# Altium schematic sheet Top.SchDoc: Top
size A; Author: CLS Team; Revision: 1.0; SheetNumber: 1; SheetTotal: 10
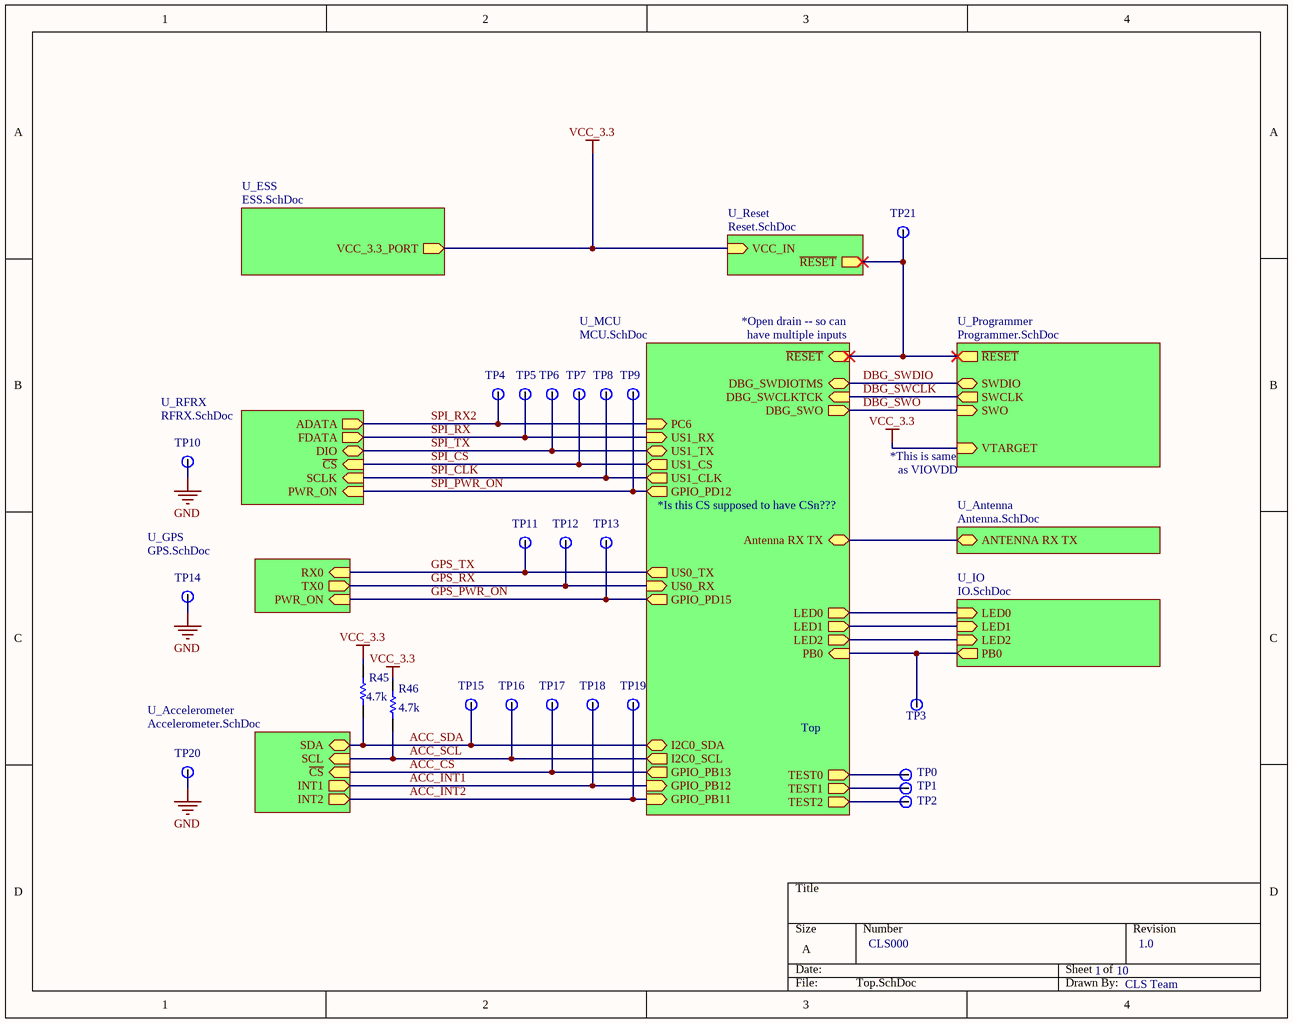
[diagram p0: Top.SchDoc]

## Parts
R45  value 4.7k  [0805_CHIP_FP]  (hidden comment: Resistor_0805)
R46  value 4.7k  [0805_CHIP_FP]  (hidden comment: Resistor_0805)
TP0  Testpoint  [HDR1X1]  (value not drawn)
TP1  Testpoint  [HDR1X1]  (value not drawn)
TP2  Testpoint  [HDR1X1]  (value not drawn)
TP3  Testpoint  [HDR1X1]  (value not drawn)
TP4  Testpoint  [HDR1X1]  (value not drawn)
TP5  Testpoint  [HDR1X1]  (value not drawn)
TP6  Testpoint  [HDR1X1]  (value not drawn)
TP7  Testpoint  [HDR1X1]  (value not drawn)
TP8  Testpoint  [HDR1X1]  (value not drawn)
TP9  Testpoint  [HDR1X1]  (value not drawn)
TP10  Testpoint  [HDR1X1]  (value not drawn)
TP11  Testpoint  [HDR1X1]  (value not drawn)
TP12  Testpoint  [HDR1X1]  (value not drawn)
TP13  Testpoint  [HDR1X1]  (value not drawn)
TP14  Testpoint  [HDR1X1]  (value not drawn)
TP15  Testpoint  [HDR1X1]  (value not drawn)
TP16  Testpoint  [HDR1X1]  (value not drawn)
TP17  Testpoint  [HDR1X1]  (value not drawn)
TP18  Testpoint  [HDR1X1]  (value not drawn)
TP19  Testpoint  [HDR1X1]  (value not drawn)
TP20  Testpoint  [HDR1X1]  (value not drawn)
TP21  Testpoint  [HDR1X1]  (value not drawn)

## Sub-sheets
U_Accelerometer = Accelerometer.SchDoc: INT2 (out), SDA (bidir), ~{CS} (in), SCL (in), INT1 (out)
U_Antenna = Antenna.SchDoc: ANTENNA RX TX (bidir)
U_ESS = ESS.SchDoc: VCC_3.3_PORT (out)
U_GPS = GPS.SchDoc: RX0 (in), TX0 (out), PWR_ON (in)
U_IO = IO.SchDoc: LED0 (in), LED1 (in), PB0 (out), LED2 (in)
U_MCU = MCU.SchDoc: US0_RX (in), US0_TX (out), I2C0_SDA (bidir), I2C0_SCL (out), GPIO_PB13 (out), DBG_SWO (out), DBG_SWCLKTCK (in), DBG_SWDIOTMS (bidir), GPIO_PB12 (in), US1_TX (bidir), US1_RX (in), US1_CS (out), US1_CLK (out), GPIO_PD12 (out), GPIO_PB11 (in), ~{RESET} (in), Antenna RX TX (bidir), PC6 (in), GPIO_PD15 (out), LED0 (out), LED2 (out), PB0 (in), TEST1 (out), LED1 (out), TEST2 (out), TEST0 (out)
U_Programmer = Programmer.SchDoc: VTARGET (in), SWDIO (bidir), SWCLK (out), SWO (in), ~{RESET} (out)
U_Reset = Reset.SchDoc: VCC_IN (in), ~{RESET} (out)
U_RFRX = RFRX.SchDoc: SCLK (in), DIO (bidir), ~{CS} (in), FDATA (out), PWR_ON (in), ADATA (out)

## Nets
GND: TP10.1(OUT) TP14.1(OUT) TP20.1(OUT)
VCC_3.3: R45.2 R46.2 ; sheet U_Programmer/VTARGET, sheet U_ESS/VCC_3.3_PORT, sheet U_Reset/VCC_IN
ACC_~{CS}: TP17.1(OUT) ; sheet U_MCU/GPIO_PB13, sheet U_Accelerometer/~{CS}
ACC_INT1: TP18.1(OUT) ; sheet U_MCU/GPIO_PB12, sheet U_Accelerometer/INT1
ACC_INT2: TP19.1(OUT) ; sheet U_MCU/GPIO_PB11, sheet U_Accelerometer/INT2
ACC_SCL: R46.1 TP16.1(OUT) ; sheet U_MCU/I2C0_SCL, sheet U_Accelerometer/SCL
ACC_SDA: R45.1 TP15.1(OUT) ; sheet U_MCU/I2C0_SDA, sheet U_Accelerometer/SDA
DBG_SWCLK: sheet U_MCU/DBG_SWCLKTCK, sheet U_Programmer/SWCLK
DBG_SWDIO: sheet U_MCU/DBG_SWDIOTMS, sheet U_Programmer/SWDIO
DBG_SWO: sheet U_MCU/DBG_SWO, sheet U_Programmer/SWO
GPS_PWR_ON: TP13.1(OUT) ; sheet U_MCU/GPIO_PD15, sheet U_GPS/PWR_ON
GPS_RX: TP12.1(OUT) ; sheet U_MCU/US0_RX, sheet U_GPS/TX0
GPS_TX: TP11.1(OUT) ; sheet U_MCU/US0_TX, sheet U_GPS/RX0
SPI_~{CS}: TP7.1(OUT) ; sheet U_MCU/US1_CS, sheet U_RFRX/~{CS}
SPI_CLK: TP8.1(OUT) ; sheet U_MCU/US1_CLK, sheet U_RFRX/SCLK
SPI_PWR_ON: TP9.1(OUT) ; sheet U_MCU/GPIO_PD12, sheet U_RFRX/PWR_ON
SPI_RX: TP5.1(OUT) ; sheet U_MCU/US1_RX, sheet U_RFRX/FDATA
SPI_RX2: TP4.1(OUT) ; sheet U_MCU/PC6, sheet U_RFRX/ADATA
SPI_TX: TP6.1(OUT) ; sheet U_MCU/US1_TX, sheet U_RFRX/DIO
NetTP0_1: TP0.1(OUT) ; sheet U_MCU/TEST0
NetTP1_1: TP1.1(OUT) ; sheet U_MCU/TEST1
NetTP2_1: TP2.1(OUT) ; sheet U_MCU/TEST2
NetTP3_1: TP3.1(OUT) ; sheet U_MCU/PB0, sheet U_IO/PB0
NetTP21_1: TP21.1(OUT) ; sheet U_MCU/~{RESET}, sheet U_Programmer/~{RESET}, sheet U_Reset/~{RESET}
(unnamed): sheet U_MCU/Antenna RX TX, sheet U_Antenna/ANTENNA RX TX
(unnamed): sheet U_MCU/LED0, sheet U_IO/LED0
(unnamed): sheet U_MCU/LED2, sheet U_IO/LED2
(unnamed): sheet U_MCU/LED1, sheet U_IO/LED1

## Notes on the sheet
- *Open drain -- so can
- have multiple inputs
- *This is same
- as VIOVDD
- *Is this CS supposed to have CSn???
- CLS000

## Library data of the parts
R45 R46 = Resistor_0805: Resistor 0805; Manufacturer: Yageo; Manufacturer Part Number: RC0805JR-074K7L; Vendor Part Number: 311-4.7KARCT-ND; Vendor: Digikey; Vendor Description: RES SMD 4.7K OHM 5% 1/8W 0805; ComponentLink1Description: Datasheet; ComponentLink1URL: https://www.digikey.com/product-detail/en/yageo/RC0805JR-074K7L/311-4.7KARCT-ND/731274; Cost: .04
TP0-TP21 = Testpoint: Vendor Part Number: PRT-00116; Vendor: Sparkfun; Vendor Description: Break Away Headers - Straight; ComponentLink1URL: https://www.sparkfun.com/products/116; ComponentLink1Description: Datasheet; Manufacturer: Sparkfun; Manufacturer Part Number: PRT-00116; Cost: bulk